# Altium schematic sheet hdmi addon.SchDoc
size A
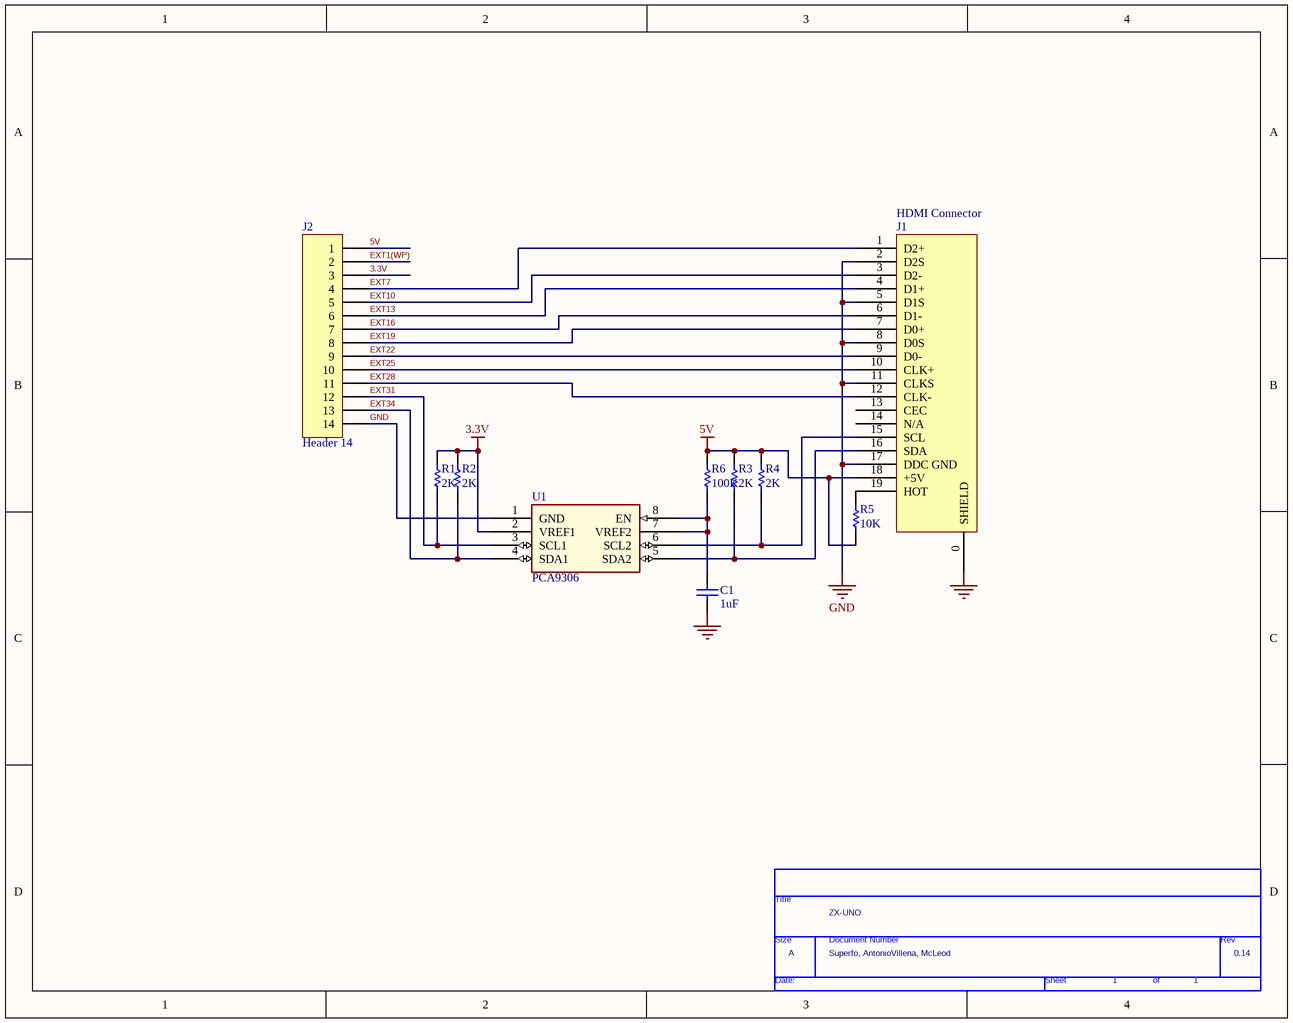
[diagram p0: hdmi addon.SchDoc]

## Parts
*  Page Count: 1  Page Size: A  Title: ZX-UNO  RevCode: 0.14  Doc: Superfo, AntonioVillena, McLeod  (hidden comment: TitleBlock0)  (graphical)
C1  value 1uF  [CAPC2012M]  (hidden comment: Cap)
J1  HDMI Connector  [HDMI 10029449]
J2  Header 14  [HDR1X14]
R1  value 2K  [RESC2012M]  (hidden comment: Res1)
R2  value 2K  [RESC2012M]  (hidden comment: Res1)
R3  value 2K  [RESC2012M]  (hidden comment: Res1)
R4  value 2K  [RESC2012M]  (hidden comment: Res1)
R5  value 10K  [RESC2012M]  (hidden comment: Res1)
R6  value 100K  [RESC2012M]  (hidden comment: Res1)
U1  PCA9306  [SOJ.050/8/WB.300/L.200]

## Nets
3.3V: J2.3 R1.2 R2.2 U1.2(VREF1)
5V: J1.18(+5V) J2.1 R3.2 R4.2 R5.1 R6.2
GND: C1.1 J1.0(SHIELD) J1.2(D2S) J1.5(D1S) J1.8(D0S) J1.11(CLKS) J1.17(DDC_GND) J2.14 U1.1(GND)
EXT1(WP): J2.2
EXT7: J1.1(D2+) J2.4
EXT10: J1.3(D2-) J2.5
EXT13: J1.4(D1+) J2.6
EXT16: J1.6(D1-) J2.7
EXT19: J1.7(D0+) J2.8
EXT22: J1.9(D0-) J2.9
EXT25: J1.10(CLK+) J2.10
EXT28: J1.12(CLK-) J2.11
EXT31: J2.12 R1.1 U1.3(SCL1)
EXT34: J2.13 R2.1 U1.4(SDA1)
NetC1_2: C1.2 R6.1 U1.7(VREF2) U1.8(EN)
NetJ1_15: J1.15(SCL) R4.1 U1.6(SCL2)
NetJ1_16: J1.16(SDA) R3.1 U1.5(SDA2)
NetJ1_19: J1.19(HOT) R5.2

Not connected (* = marked no-connect by the designer): J1 13(CEC) 14(N/A)

## Notes on the sheet
- (in symbol TitleBlock0) Title; Size; Document Number; Rev; Date:; Sheet; of

## Library data of the parts
C1 = Cap: Capacitor; Published: 8-Jun-2000; LatestRevisionDate: 17-Jul-2002; LatestRevisionNote: Re-released for DXP Platform.; PackageReference: RAD-0.3; Publisher: Altium Limited
J1 = D-300-0056: HDMI, SMD, R/A KDMIX-NS1-WS-B; Connector type: Right Angle; Max Current: mA; Mounting Technology: Surface Mount; Pin Count: 19; Status: Unreleased; Category: Connector
J2 = Header 14: Header, 14-Pin; LatestRevisionDate: 17-Jul-2002; LatestRevisionNote: Re-released for DXP Platform.; Publisher: Altium Limited
R1-R6 = Res1: Resistor; Published: 8-Jun-2000; LatestRevisionDate: 17-Jul-2002; LatestRevisionNote: Re-released for DXP Platform.; PackageReference: AXIAL-0.3; Publisher: Altium Limited
* = TitleBlock0: Page Number: 1; Page Create Date: March  8, 1995